# EAGLE design conector_driver (EAGLE 5.08)
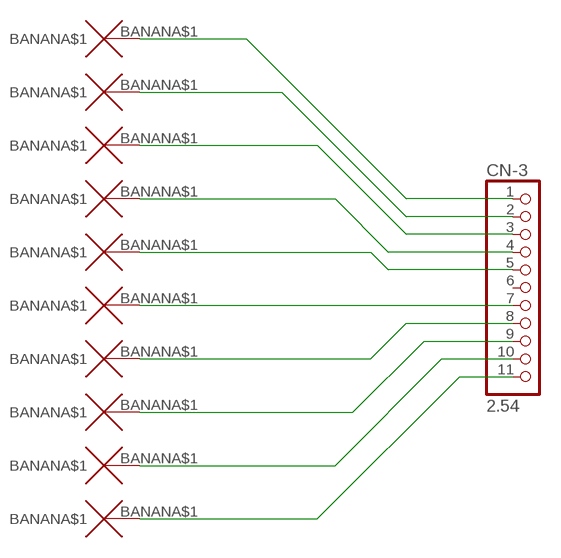
[diagram p0: schematic, sheet 1]

## Parts
AG  BANANA  [BANANA]
ALM  BANANA  [BANANA]
CN-3  2.54  PINHD-1X11/90  [1X11/90]
COM+  BANANA  [BANANA]
DG  BANANA  [BANANA]
PULS+  BANANA  [BANANA]
PULS-  BANANA  [BANANA]
SIGN+  BANANA  [BANANA]
SIGN-  BANANA  [BANANA]
SON  BANANA  [BANANA]
VC+  BANANA  [BANANA]

## Nets
N$1: CN-3.1 COM+.BANANA$1
N$2: CN-3.2 SON.BANANA$1
N$3: CN-3.3 PULS+.BANANA$1
N$4: CN-3.4 PULS-.BANANA$1
N$5: CN-3.5 SIGN+.BANANA$1
N$6: CN-3.7 SIGN-.BANANA$1
N$7: CN-3.8 VC+.BANANA$1
N$8: AG.BANANA$1 CN-3.9
N$9: CN-3.10 DG.BANANA$1
N$10: ALM.BANANA$1 CN-3.11
Unconnected: CN-3.6

## Library data of the parts
AG ALM COM+ DG PULS+ PULS- SIGN+ SIGN- SON VC+ = wirepad:BANANA
CN-3 = pinhead:PINHD-1X11: PIN HEADER

## Board
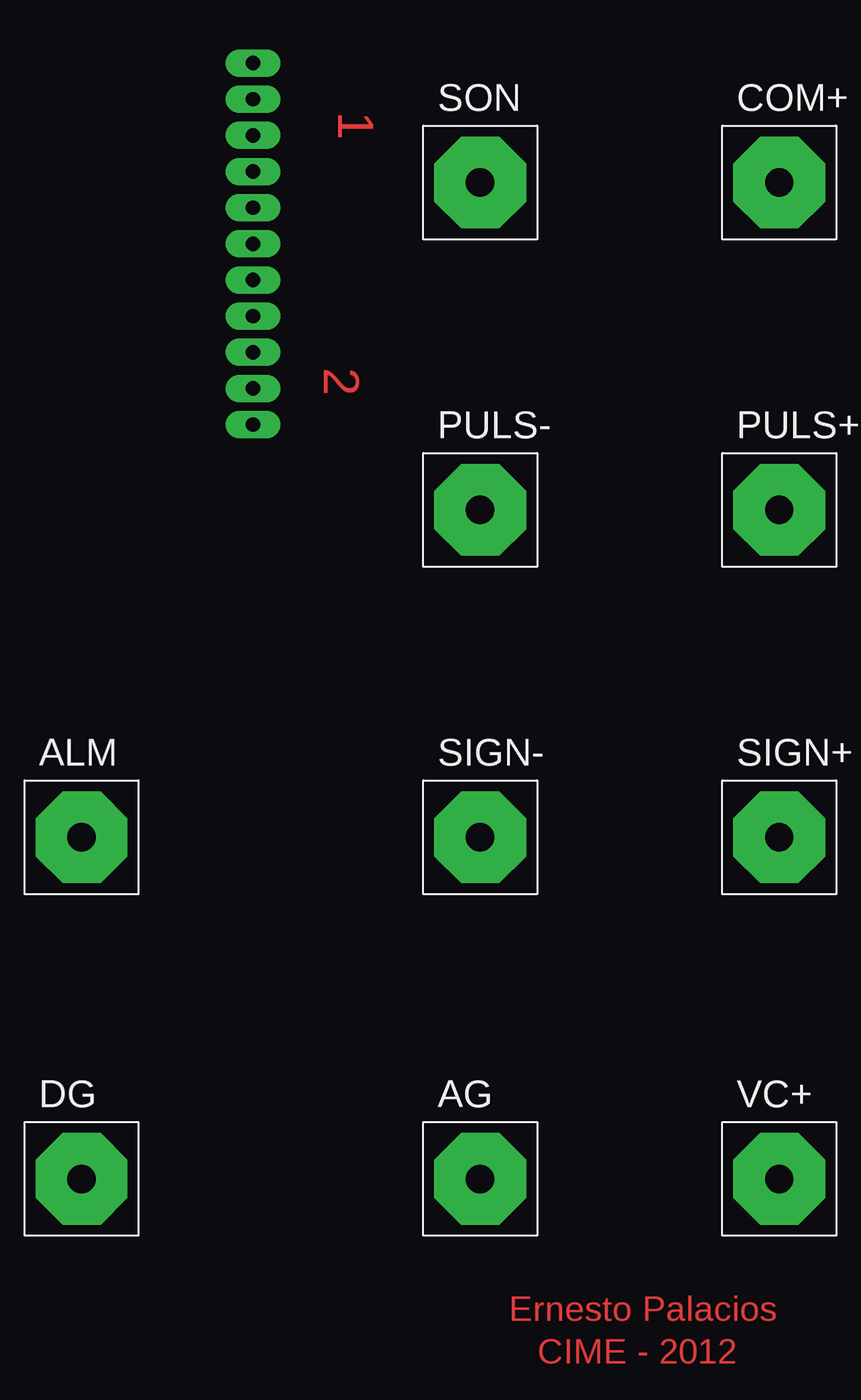
[diagram p1: board, top side]
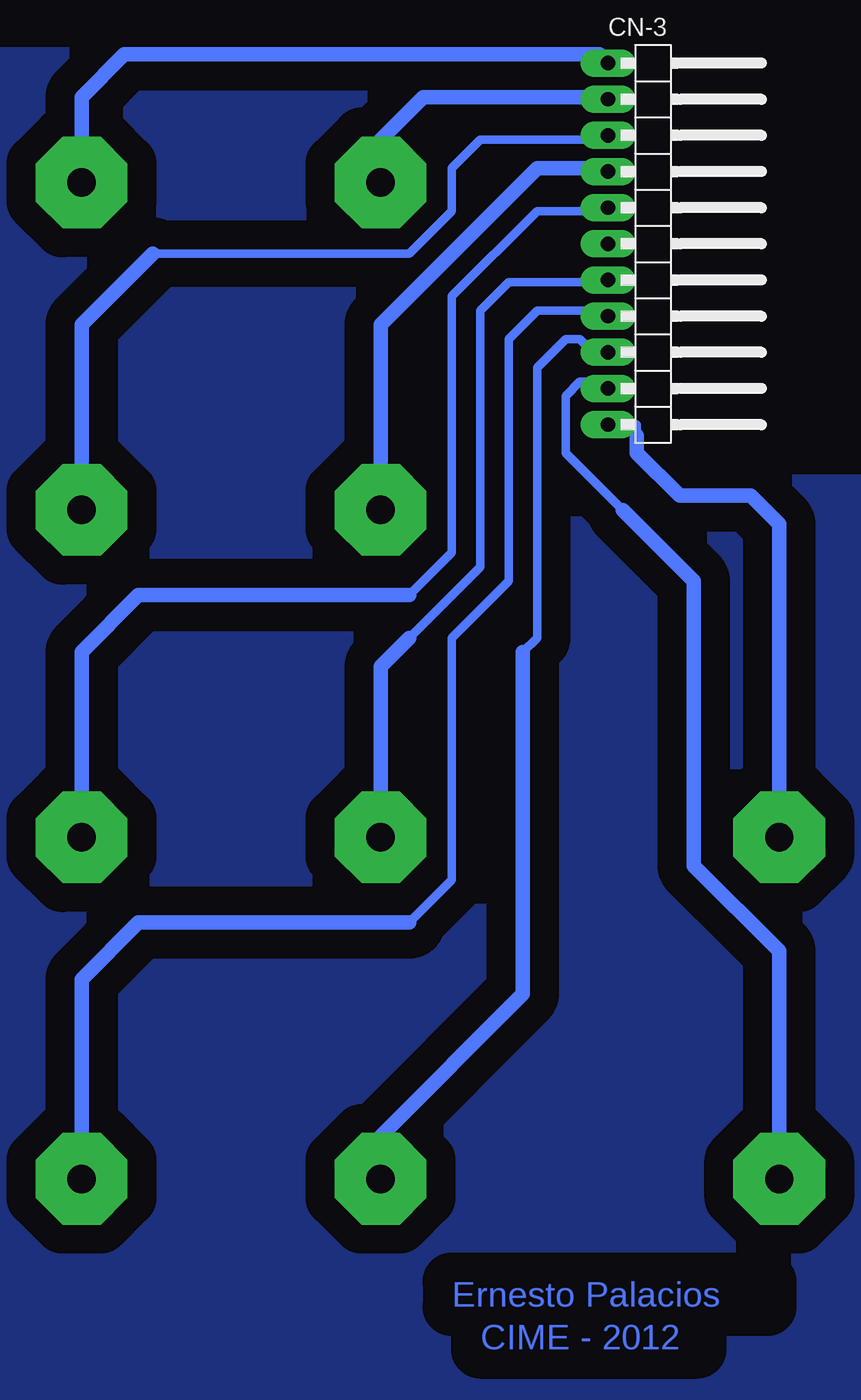
[diagram p2: board, bottom side, seen from below]

No outline drawn. Coordinates in mm, seen from the top.
Copper layers (1*16): Top 0.035mm / dielectric 1.5mm / Bottom 0.035mm
Design rules "default *": minimum track width 10mil, minimum drill 24mil, track to track 80mil, track to pad 80mil, pad to pad 80mil, via to via 80mil, smd to smd 18mil, copper to edge 40mil, drill to drill 8mil, minimum pad ring 18mil, minimum via ring 8mil, stop-mask expansion 4mil, vias tented up to drill 0mil, thermal gap 10mil

### Footprints (pad centres in the part's own frame; a part is rotated, then mirrored left to right if it is on the bottom)
BANANA = drill 2 pad 6.452 octagon: BANANA$1 0,0
1X11/90 = drill 1.016 long: 1 -12.7,-3.81; 2 -10.16,-3.81; 3 -7.62,-3.81; 4 -5.08,-3.81; 5 -2.54,-3.81; 6 0,-3.81; 7 2.54,-3.81; 8 5.08,-3.81; 9 7.62,-3.81; 10 10.16,-3.81; 11 12.7,-3.81

### Placement (x,y rotation side)
AG  46,19 0 top
ALM  18,43 0 top
CN-3  26.22,84.69 270 bottom
COM+  67,89 0 top
DG  18,19 0 top
PULS+  67,66 0 top
PULS-  46,66 0 top
SIGN+  67,43 0 top
SIGN-  46,43 0 top
SON  46,89 0 top
VC+  67,19 0 top

### Tracks (layer width: path | path; a pad name or v marks a point on that pad's centre or on a via)
GND
  pour Bottom: 2,2 2,68 26,68 28,70 28,98 78,98 78,2
N$1
  Bottom 1.016: COM+.BANANA$1 67,95 64,98 30.64,98 CN-3.1
N$2
  Bottom 1.016: SON.BANANA$1 46,92 43,95 30,95 30,94.88 CN-3.2
N$3
  Bottom 0.61: 62,84 44,84 41,87 41,90 39,92 30.34,92 CN-3.3
  Bottom 1.016: PULS+.BANANA$1 67,79 62,84
N$4
  Bottom 1.016: PULS-.BANANA$1 46,79 35,90 30.26,90 CN-3.4
N$5
  Bottom 0.61: 44,60 41,63 41,81 35,87 30.26,87 CN-3.5
  Bottom 1.016: SIGN+.BANANA$1 67,56 63,60 44,60
N$6
  Bottom 0.61: 44,57 39,62 39,80 37,82 30.18,82 CN-3.7
  Bottom 1.016: SIGN-.BANANA$1 46,55 44,57
N$7
  Bottom 0.61: 44,37 41,40 41,57 37,61 37,78 35,80 30.42,80 CN-3.8
  Bottom 1.016: VC+.BANANA$1 67,33 63,37 44,37
N$8
  Bottom 0.61: 36,56 35,57 35,76 33,78 32,78 31,77 30.1,77 CN-3.9
  Bottom 1.016: AG.BANANA$1 46,22 36,32 36,56
N$9
  Bottom 0.61: 29,66 33,70 33,74 32,75 30.5,75 CN-3.10
  Bottom 1.016: DG.BANANA$1 18,35 24,41 24,61 29,66
N$10
  Bottom 0.61: 28,71.23 28,71.99 | 28,71.99 CN-3.11 | 28,71.99 28,72
  Bottom 1.016: ALM.BANANA$1 18,65 20,67 25,67 28,70 28,71.23

### Text on the board
Top: 1 | 2 | Ernesto Palacios | CIME - 2012
Bottom: Ernesto Palacios | CIME - 2012